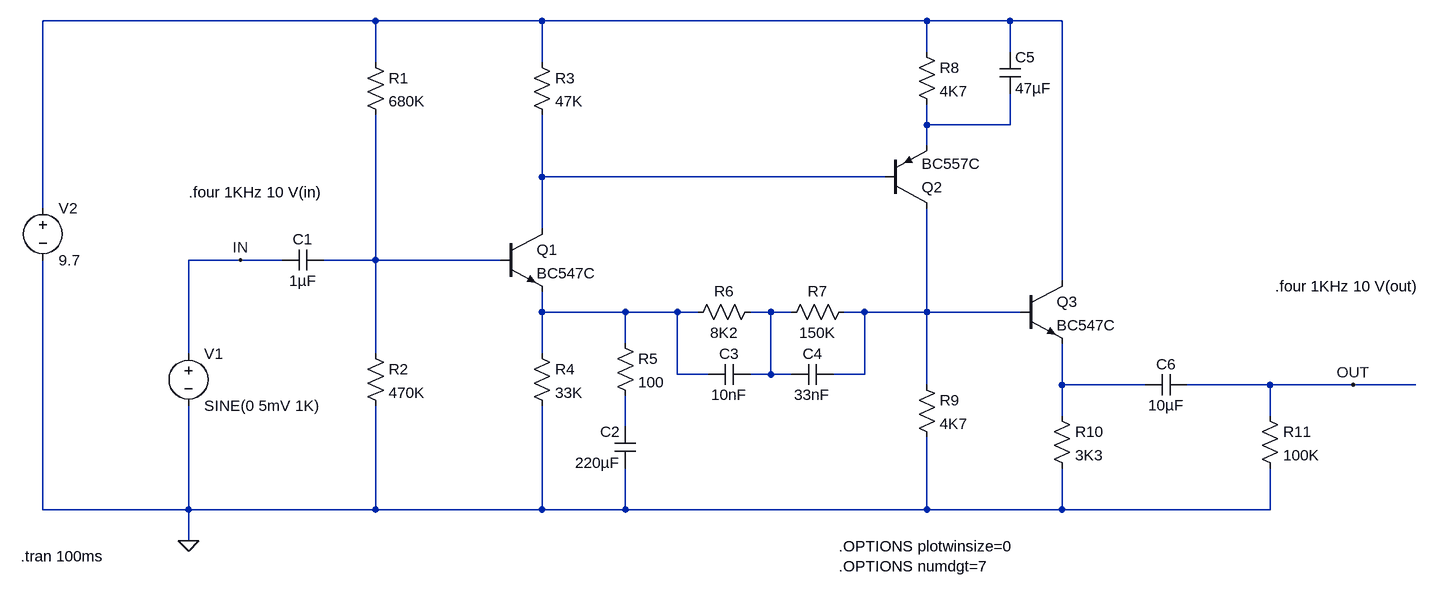
[diagram p0: schematic RIAA.asc]
RIAA.asc, the LTspice schematic file:
Version 4
SHEET 1 1484 680
WIRE -144 -208 -656 -208
WIRE 112 -208 -144 -208
WIRE 704 -208 112 -208
WIRE 832 -208 704 -208
WIRE 912 -208 832 -208
WIRE 704 -160 704 -208
WIRE 832 -160 832 -208
WIRE -144 -144 -144 -208
WIRE 112 -144 112 -208
WIRE 704 -48 704 -80
WIRE 832 -48 832 -96
WIRE 832 -48 704 -48
WIRE 704 -16 704 -48
WIRE 112 32 112 -64
WIRE 640 32 112 32
WIRE -656 80 -656 -208
WIRE 112 112 112 32
WIRE -352 160 -432 160
WIRE -288 160 -352 160
WIRE -144 160 -144 -64
WIRE -144 160 -224 160
WIRE 48 160 -144 160
WIRE 912 192 912 -208
WIRE 112 240 112 208
WIRE 240 240 112 240
WIRE 320 240 240 240
WIRE 352 240 320 240
WIRE 464 240 432 240
WIRE 496 240 464 240
WIRE 608 240 576 240
WIRE 704 240 704 80
WIRE 704 240 608 240
WIRE 848 240 704 240
WIRE 240 288 240 240
WIRE -432 304 -432 160
WIRE -144 304 -144 160
WIRE 112 304 112 240
WIRE 320 336 320 240
WIRE 368 336 320 336
WIRE 464 336 464 240
WIRE 464 336 432 336
WIRE 496 336 464 336
WIRE 608 336 608 240
WIRE 608 336 560 336
WIRE 704 352 704 240
WIRE 912 352 912 288
WIRE 1040 352 912 352
WIRE 1232 352 1104 352
WIRE 1360 352 1232 352
WIRE 1456 352 1360 352
WIRE 912 400 912 352
WIRE 1232 400 1232 352
WIRE 240 416 240 368
WIRE -656 544 -656 160
WIRE -432 544 -432 384
WIRE -432 544 -656 544
WIRE -144 544 -144 384
WIRE -144 544 -432 544
WIRE 112 544 112 384
WIRE 112 544 -144 544
WIRE 240 544 240 480
WIRE 240 544 112 544
WIRE 704 544 704 432
WIRE 704 544 240 544
WIRE 912 544 912 480
WIRE 912 544 704 544
WIRE 1232 544 1232 480
WIRE 1232 544 912 544
WIRE -432 592 -432 544
FLAG 1360 352 OUT
FLAG -432 592 0
FLAG -352 160 IN
SYMBOL npn 48 112 R0
SYMATTR InstName Q1
SYMATTR Value BC547C
SYMBOL pnp 640 80 M180
SYMATTR InstName Q2
SYMATTR Value BC557C
SYMBOL res -160 -160 R0
SYMATTR InstName R1
SYMATTR Value 680K
SYMBOL res -160 288 R0
SYMATTR InstName R2
SYMATTR Value 470K
SYMBOL res 96 -160 R0
SYMATTR InstName R3
SYMATTR Value 47K
SYMBOL res 96 288 R0
SYMATTR InstName R4
SYMATTR Value 33K
SYMBOL res 224 272 R0
SYMATTR InstName R5
SYMATTR Value 100
SYMBOL res 448 224 R90
WINDOW 0 0 56 VBottom 2
WINDOW 3 32 56 VTop 2
SYMATTR InstName R6
SYMATTR Value 8K2
SYMBOL res 592 224 R90
WINDOW 0 0 56 VBottom 2
WINDOW 3 32 56 VTop 2
SYMATTR InstName R7
SYMATTR Value 150K
SYMBOL res 688 -176 R0
SYMATTR InstName R8
SYMATTR Value 4K7
SYMBOL res 688 336 R0
SYMATTR InstName R9
SYMATTR Value 4K7
SYMBOL res 896 384 R0
SYMATTR InstName R10
SYMATTR Value 3K3
SYMBOL res 1216 384 R0
SYMATTR InstName R11
SYMATTR Value 100K
SYMBOL npn 848 192 R0
SYMATTR InstName Q3
SYMATTR Value BC547C
SYMBOL cap -224 144 R90
WINDOW 0 0 32 VBottom 2
WINDOW 3 32 32 VTop 2
SYMATTR InstName C1
SYMATTR Value 1µF
SYMBOL cap 256 480 R180
WINDOW 0 24 56 Left 2
WINDOW 3 24 8 Left 2
SYMATTR InstName C2
SYMATTR Value 220µF
SYMBOL cap 368 352 R270
WINDOW 0 32 32 VTop 2
WINDOW 3 0 32 VBottom 2
SYMATTR InstName C3
SYMATTR Value 10nF
SYMBOL cap 496 352 R270
WINDOW 0 32 32 VTop 2
WINDOW 3 0 32 VBottom 2
SYMATTR InstName C4
SYMATTR Value 33nF
SYMBOL cap 816 -160 R0
SYMATTR InstName C5
SYMATTR Value 47µF
SYMBOL cap 1104 336 R90
WINDOW 0 0 32 VBottom 2
WINDOW 3 32 32 VTop 2
SYMATTR InstName C6
SYMATTR Value 10µF
SYMBOL voltage -432 288 R0
WINDOW 123 0 0 Left 0
WINDOW 39 0 0 Left 0
SYMATTR InstName V1
SYMATTR Value SINE(0 5mV 1K)
SYMBOL voltage -656 64 R0
WINDOW 123 0 0 Left 0
WINDOW 39 0 0 Left 0
SYMATTR InstName V2
SYMATTR Value 9.7
TEXT -690 616 Left 2 !.tran 100ms
TEXT 1240 200 Left 2 !.four 1KHz 10 V(out)
TEXT -432 56 Left 2 !.four 1KHz 10 V(in)
TEXT 568 600 Left 2 !.OPTIONS plotwinsize=0\n.OPTIONS numdgt=7

The netlist it stands for:
* RIAA.asc
Q1 N003 N004 N005 0 BC547C
Q2 N007 N003 N002 0 BC557C
R1 N001 N004 680K
R2 N004 0 470K
R3 N001 N003 47K
R4 N005 0 33K
R5 N005 N009 100
R6 N006 N005 8K2
R7 N007 N006 150K
R8 N001 N002 4K7
R9 N007 0 4K7
R10 N008 0 3K3
R11 OUT 0 100K
Q3 N001 N007 N008 0 BC547C
C1 N004 IN 1µF
C2 0 N009 220µF
C3 N005 N006 10nF
C4 N006 N007 33nF
C5 N001 N002 47µF
C6 OUT N008 10µF
V1 IN 0 SINE(0 5mV 1K)
V2 N001 0 9.7
.model NPN NPN
.model PNP PNP
.lib standard.bjt
.tran 100ms
.four 1KHz 10 V(out)
.four 1KHz 10 V(in)
.OPTIONS plotwinsize=0
.OPTIONS numdgt=7
.backanno
.end